# Altium schematic sheet mcu_valdis2.SchDoc
size A4; SheetNumber: 3; SheetTotal: 4
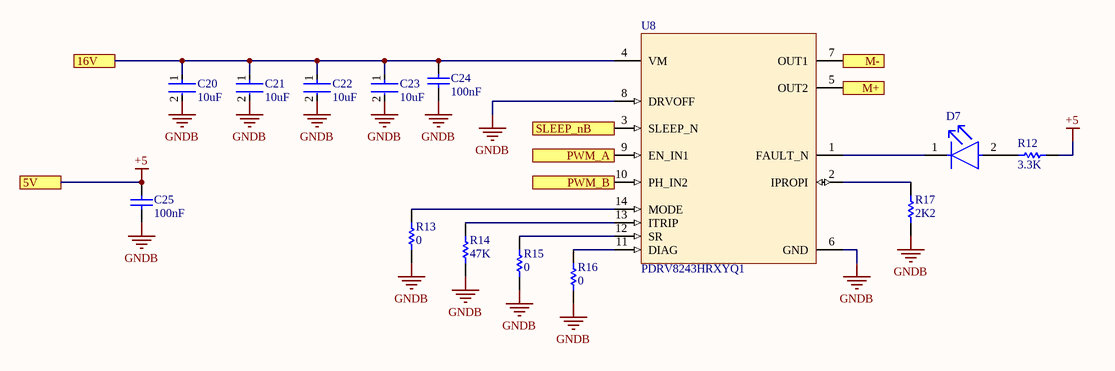
[diagram p0: mcu_valdis2.SchDoc]

## Parts
C20  10uF  [FP-CL21-IPC_C]
C21  10uF  [FP-CL21-IPC_C]
C22  10uF  [FP-CL21-IPC_C]
C23  10uF  [FP-CL21-IPC_C]
C24  100nF  [CAPC1608X90X35ML10T15]
C25  100nF  [CAPC1608X90X35ML10T15]
D7  LTST-C191TBKT  [FP-LTST-C191TBKT-MFG]  (value not drawn)
R12  3.3K  [RESC1609X50X30NL8T20]
R13  0  [RESC1609X50X30NL8T20]
R14  47K  [RESC1609X50X30NL8T20]
R15  0  [RESC1609X50X30NL8T20]
R16  0  [RESC1609X50X30NL8T20]
R17  2K2  [RESC1609X50X30NL8T20]
U8  PDRV8243HRXYQ1  [RXY0014A-MFG]

## Ports
5V (see mainboard_valdis[3C], mcu_valdis1[1B], mcu_valdis3[1B]), 16V (see mainboard_valdis[3C], mcu_valdis1[1B], mcu_valdis3[1B]), M+ (out, see mainboard_valdis[4C]), M- (out, see mainboard_valdis[4C]), PWM_A (in, see mainboard_valdis[3C]), PWM_B (in, see mainboard_valdis[3C]), SLEEP_nB (in, see mainboard_valdis[3C], mcu_valdis1[2B], mcu_valdis3[2B])

## Nets
+5: C25.2 R12.2 ; port 5V
GNDB: C20.2 C21.2 C22.2 C23.2 C24.1 C25.1 R13.1 R14.1 R15.1 R16.1 R17.1 U8.6(GND) U8.8(DRVOFF)
16V: C20.1 C21.1 C22.1 C23.1 C24.2 U8.4(VM) ; port 16V
M+: U8.5(OUT2) ; port M+
M-: U8.7(OUT1) ; port M-
PWM_A: U8.9(EN_IN1) ; port PWM_A
PWM_B: U8.10(PH_IN2) ; port PWM_B
SLEEP_nB: U8.3(SLEEP_N) ; port SLEEP_nB
NetD7_1: D7.1(C) U8.1(FAULT_N)
NetD7_2: D7.2(A) R12.1
NetR13_2: R13.2 U8.14(MODE)
NetR14_2: R14.2 U8.13(ITRIP)
NetR15_2: R15.2 U8.12(SR)
NetR16_2: R16.2 U8.11(DIAG)
NetR17_2: R17.2 U8.2(IPROPI)

## Library data of the parts
C20-C23 = CMP-13271-003225-1: CL21 Series 0805 22uF 25V ±20% Tolerance X5R Multilayer Ceramic Chip Capacitor
C24 C25 = CMP-2000-04945-1: Chip Capacitor, 22 pF, +/- 5%, 50 V, -55 to 125 degC, 0603 (1608 Metric), RoHS, Tape and Reel; Manufacturer: Murata; Capacitance: 22pF; Rated Voltage: 50V; Dielectric: C0G; Manufacturer URL: http://www.murata.com/; Datasheet Version: Jul-06; Package Reference: 603; Tolerance (%): ±5%; Case Size/Dimension: 0603; Package Description: 2-Pin Surface Mount Device, Body 1.6 x 0.8 mm; Datasheet URL: https://datasheet.ciiva.com/11786/0900766b807a1cab-11786398.pdf
D7 = CMP-22017-000008-1: LED BLUE CLEAR CHIP SMD; Lens Color: Colorless; Dominant Wavelength: 475nm; Forward Current: 20mA; Wavelength: 468nm; Viewing Angle: 130°; Power Dissipation: 76mW; Luminous Intensity: 180mcd; Reverse Voltage: 5V; Number of Elements: 1; Lens Style: Diffused; Forward Voltage: 3.8V; Max Power Dissipation: 75mW; Case Code (Metric): 1608; Packaging: Tape and Reel; Case/Package: 0603; Depth: 1.6mm; Mount: Surface Mount; Lead Free: Lead Free; Min Operating Temperature: -20°C; Lens Transparency: Clear; Illumination Color: Blue; Height: 0.55mm; Test Current: 20mA; Case Code (Imperial): 0603; Max Operating Temperature: 80°C; Number of Pins: 2; Length: 0.8mm; Radiation Hardening: No; Package Quantity: 1; Number of LEDs: 1; Width: 0.8mm; Color: Blue
R12-R17 = CMP-2000-03816-5: Chip Resistor, 0 Ohm, Jumper, 100 mW, -55 to 155 degC, 0603 (1608 Metric), RoHS, Tape and Reel; Manufacturer: Vishay Semiconductor; Voltage Rating: 75 V; Package Quantity: 5000; DatasheetVersion: 06/2012; Min Operating Temperature: -55 degC; ComponentLink1URL: http://www.vishay.com/; Mounting Technology: Surface Mount; Height: 0.45 mm; ComponentLink1Description: Manufacturer URL; REACH SVHC: Unknown; PackageReference: 0603; Packaging: Tape and Reel; Max Operating Temperature: 155 degC; Mount: Surface Mount; ComponentLink2Description: Datasheet; PackageDescription: 2-Pin Surface Mount Device, Body 1.575 x 0.85 mm; Length: 1.55 mm; ComponentLink2URL: http://www.vishay.com/docs/20035/dcrcwe3.pdf; Pins: 2; RoHSCompliant: true
U8 = PDRV8243HRXYQ1: No Description Available; Mfr_Name: Texas Instruments; Type: DEV; RefDes: RefDes; Copyright: Copyright (C) 2022 Ultra Librarian. All rights reserved.; Manufacturer_Part_Number: PDRV8243HRXYQ1